# Altium schematic sheet Bus.schdoc
size 171 x 73 mm
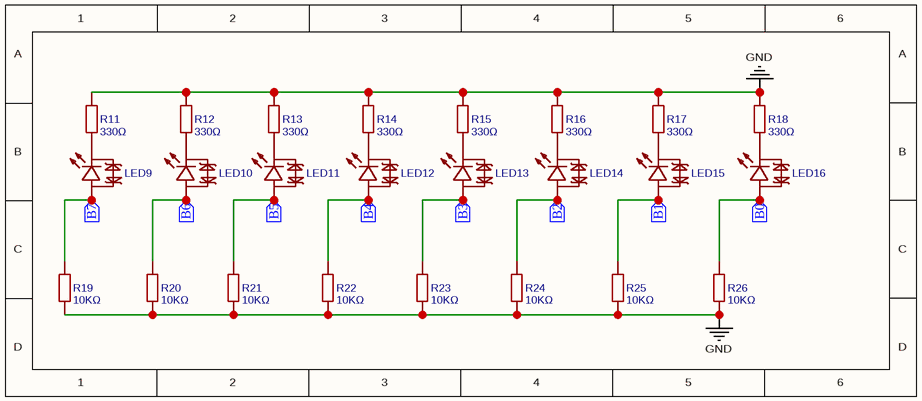
[diagram p0: Bus.schdoc]

## Parts
LED9  204-15UTC/S400-X9-L  [LED-TH_BD3.0-P2.54-FD]  (value not drawn)
LED10  204-15UTC/S400-X9-L  [LED-TH_BD3.0-P2.54-FD]  (value not drawn)
LED11  204-15UTC/S400-X9-L  [LED-TH_BD3.0-P2.54-FD]  (value not drawn)
LED12  204-15UTC/S400-X9-L  [LED-TH_BD3.0-P2.54-FD]  (value not drawn)
LED13  204-15UTC/S400-X9-L  [LED-TH_BD3.0-P2.54-FD]  (value not drawn)
LED14  204-15UTC/S400-X9-L  [LED-TH_BD3.0-P2.54-FD]  (value not drawn)
LED15  204-15UTC/S400-X9-L  [LED-TH_BD3.0-P2.54-FD]  (value not drawn)
LED16  204-15UTC/S400-X9-L  [LED-TH_BD3.0-P2.54-FD]  (value not drawn)
R11  330Ω  [RES-TH_BD3.3-L9.0-P13.00-D0.6]
R12  330Ω  [RES-TH_BD3.3-L9.0-P13.00-D0.6]
R13  330Ω  [RES-TH_BD3.3-L9.0-P13.00-D0.6]
R14  330Ω  [RES-TH_BD3.3-L9.0-P13.00-D0.6]
R15  330Ω  [RES-TH_BD3.3-L9.0-P13.00-D0.6]
R16  330Ω  [RES-TH_BD3.3-L9.0-P13.00-D0.6]
R17  330Ω  [RES-TH_BD3.3-L9.0-P13.00-D0.6]
R18  330Ω  [RES-TH_BD3.3-L9.0-P13.00-D0.6]
R19  10KΩ  [RES-TH_BD3.3-L9.0-P13.00-D0.6]
R20  10KΩ  [RES-TH_BD3.3-L9.0-P13.00-D0.6]
R21  10KΩ  [RES-TH_BD3.3-L9.0-P13.00-D0.6]
R22  10KΩ  [RES-TH_BD3.3-L9.0-P13.00-D0.6]
R23  10KΩ  [RES-TH_BD3.3-L9.0-P13.00-D0.6]
R24  10KΩ  [RES-TH_BD3.3-L9.0-P13.00-D0.6]
R25  10KΩ  [RES-TH_BD3.3-L9.0-P13.00-D0.6]
R26  10KΩ  [RES-TH_BD3.3-L9.0-P13.00-D0.6]

## Ports
B0 (in), B1 (in), B2 (in), B3 (in), B4 (in), B5 (in), B6 (in), B7 (in)

## Nets
GND: R11.2 R12.2 R13.2 R14.2 R15.2 R16.2 R17.2 R18.2 R19.1 R20.1 R21.1 R22.1 R23.1 R24.1 R25.1 R26.1
B0: LED16.1(A) R26.2 ; port B0
B1: LED15.1(A) R25.2 ; port B1
B2: LED14.1(A) R24.2 ; port B2
B3: LED13.1(A) R23.2 ; port B3
B4: LED12.1(A) R22.2 ; port B4
B5: LED11.1(A) R21.2 ; port B5
B6: LED10.1(A) R20.2 ; port B6
B7: LED9.1(A) R19.2 ; port B7
NetLED9_2: LED9.2(C) R11.1
NetLED10_2: LED10.2(C) R12.1
NetLED11_2: LED11.2(C) R13.1
NetLED12_2: LED12.2(C) R14.1
NetLED13_2: LED13.2(C) R15.1
NetLED14_2: LED14.2(C) R16.1
NetLED15_2: LED15.2(C) R17.1
NetLED16_2: LED16.2(C) R18.1

## Library data of the parts
LED9-LED16 = 204-15UTC/S400-X9-L: Manufacturer: EVERLIGHT(亿光); Contributor: LCSC; Supplier: LCSC; Supplier Part: C282138; Manufacturer Part: 204-15UTC/S400-X9-L; JLCPCB Part Class: Extended Part; spicePre: L; spiceSymbolName: 204-15UTC/S400-X9-L
R11-R18 = 330Ω: Manufacturer: CCO(千志电子); Manufacturer Part: MF1/2W-0.1Ω±1% T; nameAlias: Value; Contributor: LCSC; Supplier: LCSC; Supplier Part: C119393; JLCPCB Part Class: Extended Part; spicePre: R; spiceSymbolName: MF1/2W-0.1Ω±1% T52
R19-R26 = 10KΩ: Manufacturer: CCO(千志电子); Manufacturer Part: MF1/2W-0.1Ω±1% T; nameAlias: Value; Contributor: LCSC; Supplier: LCSC; Supplier Part: C119393; JLCPCB Part Class: Extended Part; spicePre: R; spiceSymbolName: MF1/2W-0.1Ω±1% T52